# Altium schematic sheet bcd2seven+display.SchDoc
size A
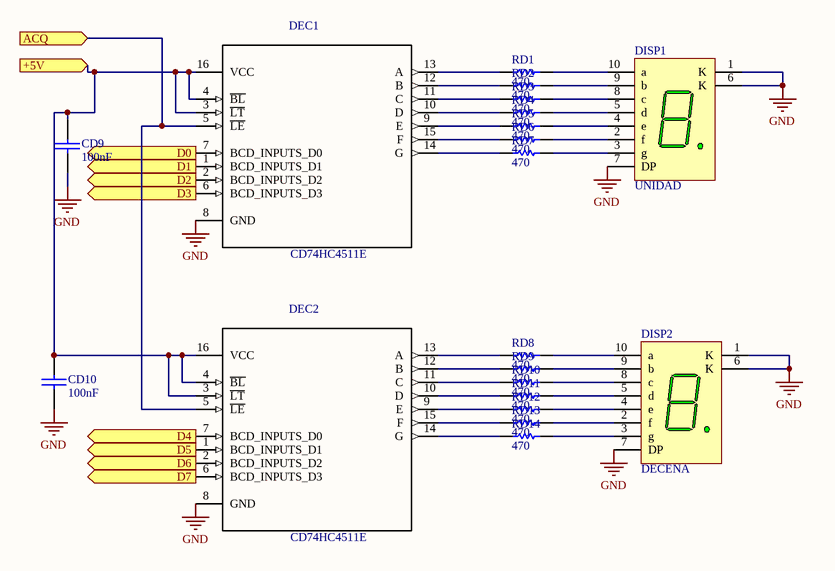
[diagram p0: bcd2seven+display.SchDoc]

## Parts
CD9  100nF  [0805]
CD10  100nF  [0805]
DEC1  CD74HC4511E  [*DIP254P762X508-16]
DEC2  CD74HC4511E  [*DIP254P762X508-16]
DISP1  UNIDAD  [DISPLAY_LED_0.3"]
DISP2  DECENA  [DISPLAY_LED_0.3"]
RD1  470  [0805]
RD2  470  [0805]
RD3  470  [0805]
RD4  470  [0805]
RD5  470  [0805]
RD6  470  [0805]
RD7  470  [0805]
RD8  470  [0805]
RD9  470  [0805]
RD10  470  [0805]
RD11  470  [0805]
RD12  470  [0805]
RD13  470  [0805]
RD14  470  [0805]

## Ports
+5V (in), ACQ (in), D0 (in), D1 (in), D2 (in), D3 (in), D4 (in), D5 (in), D6 (in), D7 (in)

## Nets
GND: CD9.2 CD10.2 DEC1.8(GND) DEC2.8(GND) DISP1.1(K) DISP1.6(K) DISP1.7(DP) DISP2.1(K) DISP2.6(K) DISP2.7(DP)
+5V: CD9.1 CD10.1 DEC1.3(~{LT}) DEC1.4(~{BL}) DEC1.16(VCC) DEC2.3(~{LT}) DEC2.4(~{BL}) DEC2.16(VCC) ; port +5V
ACQ: DEC1.5(~{LE}) DEC2.5(~{LE}) ; port ACQ
D0: DEC1.7(BCD_INPUTS_D0) ; port D0
D1: DEC1.1(BCD_INPUTS_D1) ; port D1
D2: DEC1.2(BCD_INPUTS_D2) ; port D2
D3: DEC1.6(BCD_INPUTS_D3) ; port D3
D4: DEC2.7(BCD_INPUTS_D0) ; port D4
D5: DEC2.1(BCD_INPUTS_D1) ; port D5
D6: DEC2.2(BCD_INPUTS_D2) ; port D6
D7: DEC2.6(BCD_INPUTS_D3) ; port D7
NetDEC1_9: DEC1.9(E) RD5.1
NetDEC1_10: DEC1.10(D) RD4.1
NetDEC1_11: DEC1.11(C) RD3.1
NetDEC1_12: DEC1.12(B) RD2.1
NetDEC1_13: DEC1.13(A) RD1.1
NetDEC1_14: DEC1.14(G) RD7.1
NetDEC1_15: DEC1.15(F) RD6.1
NetDEC2_9: DEC2.9(E) RD12.1
NetDEC2_10: DEC2.10(D) RD11.1
NetDEC2_11: DEC2.11(C) RD10.1
NetDEC2_12: DEC2.12(B) RD9.1
NetDEC2_13: DEC2.13(A) RD8.1
NetDEC2_14: DEC2.14(G) RD14.1
NetDEC2_15: DEC2.15(F) RD13.1
NetDISP1_2: DISP1.2(f) RD6.2
NetDISP1_3: DISP1.3(g) RD7.2
NetDISP1_4: DISP1.4(e) RD5.2
NetDISP1_5: DISP1.5(d) RD4.2
NetDISP1_8: DISP1.8(c) RD3.2
NetDISP1_9: DISP1.9(b) RD2.2
NetDISP1_10: DISP1.10(a) RD1.2
NetDISP2_2: DISP2.2(f) RD13.2
NetDISP2_3: DISP2.3(g) RD14.2
NetDISP2_4: DISP2.4(e) RD12.2
NetDISP2_5: DISP2.5(d) RD11.2
NetDISP2_8: DISP2.8(c) RD10.2
NetDISP2_9: DISP2.9(b) RD9.2
NetDISP2_10: DISP2.10(a) RD8.2

## Library data of the parts
CD9 CD10 = CAP
DEC1 DEC2 = CD74HC4511E: High Speed CMOS Logic BCD-to-7 Segment Latch/Decoder/Driver 16-PDIP -55 to 125; MF: Texas Instruments; Package: PDIP-16 Texas Instruments; MP: CD74HC4511E; Digi-Key_Purchase_URL: https://www.digikey.com/product-detail/en/texas-instruments/CD74HC4511E/296-14537-5-ND/555825?utm_source=snapeda&utm_medium=aggregator&utm_campaign=symbol; Digi-Key_Part_Number: 296-14537-5-ND; SnapEDA_Link: https://www.snapeda.com/parts/CD74HC4511E/Texas%20Instruments/view-part/?ref=snap; Value: *
DISP1 DISP2 = DISPLAY 7SEG K: Display 7 Segmentos Catodo Común
RD1-RD14 = RES